# EAGLE schematic rs232_mon (EAGLE 9.6.2)
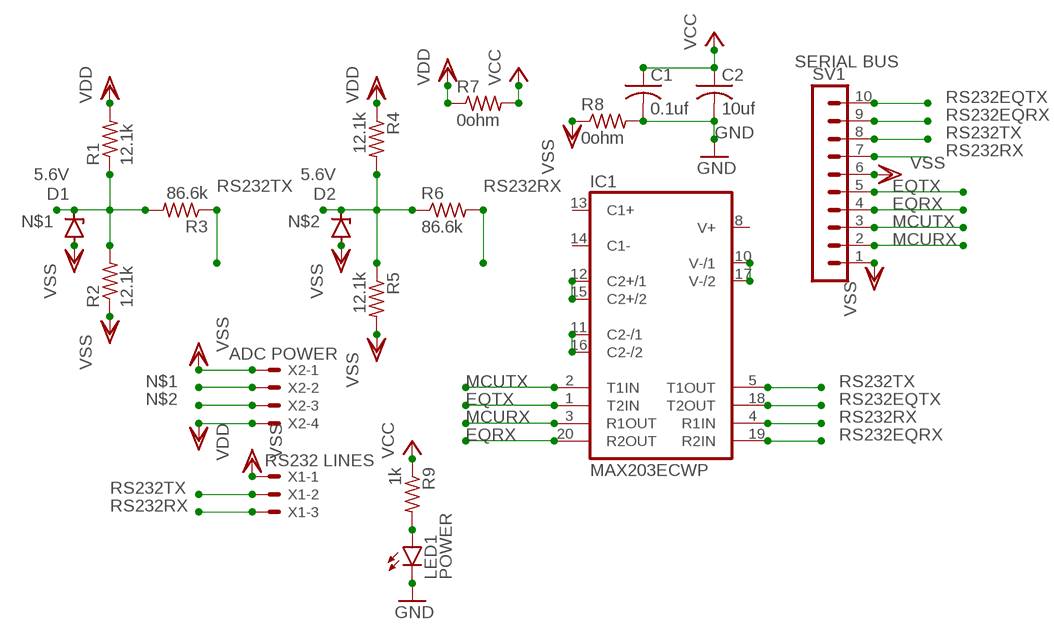
[diagram p0: schematic, sheet 1]

## Parts
C1  0.1uf  C-USC0805  [C0805]
C2  10uf  C-USC0805  [C0805]
D1  5.6V  ZENER-DIODEDO34-7  [DO34Z7]
D2  5.6V  ZENER-DIODEDO34-7  [DO34Z7]
IC1  MAX203ECWP  [SO20L]
LED1  POWER  LEDCHIP-LED0603  [CHIP-LED0603]
R1  12.1k  R-US_R0805  [R0805]
R2  12.1k  R-US_R0805  [R0805]
R3  86.6k  R-US_R0805  [R0805]
R4  12.1k  R-US_R0805  [R0805]
R5  12.1k  R-US_R0805  [R0805]
R6  86.6k  R-US_R0805  [R0805]
R7  0ohm  R-US_R0805  [R0805]
R8  0ohm  R-US_R0805  [R0805]
R9  1k  R-US_R0805  [R0805]
SV1  SERIAL BUS  MA10-1  [MA10-1]
X1  RS232 LINES  22-23-2031  [22-23-2031]
X2  ADC POWER  22-23-2041  [22-23-2041]

## Nets
EQRX: IC1.20(R2OUT) SV1.4
EQTX: IC1.1(T2IN) SV1.5
GND [current]: C1.2 C2.2 LED1.C R8.2
MCURX: IC1.3(R1OUT) SV1.2
MCUTX: IC1.2(T1IN) SV1.3
N$1: D1.C R1.1 R2.2 R3.2 X2.2
N$2: D2.C R4.2 R5.1 R6.1 X2.3
N$3: LED1.A R9.2
N$5: IC1.10(V-/1) IC1.17(V-/2)
N$6: IC1.11(C2-/1) IC1.16(C2-/2)
N$7: IC1.12(C2+/1) IC1.15(C2+/2)
RS232EQRX: IC1.19(R2IN) SV1.9
RS232EQTX: IC1.18(T2OUT) SV1.10
RS232RX: IC1.4(R1IN) R6.2 SV1.7 X1.3
RS232TX: IC1.5(T1OUT) R3.1 SV1.8 X1.2
VCC [current]: C1.1 C2.1 R7.2 R9.1
VDD [current]: R1.2 R4.1 R7.1 X2.4
VSS [current]: D1.A D2.A R2.1 R5.2 R8.1 SV1.1 SV1.6 X1.1 X2.1
Unconnected: IC1.8(V+) IC1.13(C1+) IC1.14(C1-)

## Power pins joined to a net without a drawn wire
GND: IC1.6(GND) IC1.9(GND)
VCC: IC1.7(VCC)

## Library data of the parts
C1 C2 = rcl:C-US: CAPACITOR, American symbol; SPICEPREFIX: C
D1 D2 = diode:ZENER-DIODE: Z-Diode
IC1 = maxim:MAX203ECWP: RS232 TRANSCEIVER; MPN: MAX203ECWP+G36; OC_FARNELL: 1224204; OC_NEWARK: 89K3435
LED1 = led:LED: LED OSRAM: - CHIPLED LG R971, LG N971, LY N971, LG Q971, LY Q971, LO R971, LY R971 LH N974, LH R974 LS Q976, LO Q976, LY Q976 LO Q996 - Hyper CHIPLED LW Q18S LB Q993, LB Q99A, LB R99A - SideLED LS A670, LO A670, LY A670, LG A670, LP A670 LB A673, LV A673, LT A673, LW A673 LH A674 LY A675 LS A676, LA A676, LO A676, LY A676, LW A676 LS A679, LY A679, LG A679 - Hyper Micro SIDELED® LS Y876, LA Y876, LO Y876, LY Y876 LT Y87S - SmartLED LW L88C, LW L88S LB L89C, LB L89S, LG L890 LS L89K, LO L89K, LY L89K LS L896, LA L896, LO L896, LY L896 - TOPLED LS T670, LO T670, LY T670, LG T670, LP T670 LSG T670, LSP T670, LSY T670, LOP T670, LYG T670 LG T671, LOG T671, LSG T671 LB T673, LV T673, LT T673, LW T673 LH T674 LS T676, LA T676, LO T676, LY T676, LB T676, LH T676, LSB T676, LW T676 LB T67C, LV T67C, LT T67C, LS T67K, LO T67K, LY T67K, LW E67C LS E67B, LA E67B, LO E67B, LY E67B, LB E67C, LV E67C, LT E67C LW T67C LS T679, LY T679, LG T679 LS T770, LO T770, LY T770, LG T770, LP T770 LB T773, LV T773, LT T773, LW T773 LH T774 LS E675, LA E675, LY E675, LS T675 LS T776, LA T776, LO T776, LY T776, LB T776 LHGB T686 LT T68C, LB T68C - Hyper Mini TOPLED® LB M676 - Mini TOPLED Santana® LG M470 LS M47K, LO M47K, LY M47K Source: http://www.osram.convergy.de LUXEON: - LUMILED® LXK2-PW12-R00, LXK2-PW12-S00, LXK2-PW14-U00, LXK2-PW14-V00 LXK2-PM12-R00, LXK2-PM12-S00, LXK2-PM14-U00 LXK2-PE12-Q00, LXK2-PE12-R00, LXK2-PE12-S00, LXK2-PE14-T00, LXK2-PE14-U00 LXK2-PB12-K00, LXK2-PB12-L00, LXK2-PB12-M00, LXK2-PB14-N00, LXK2-PB14-P00, LXK2-PB14-Q00 LXK2-PR12-L00, LXK2-PR12-M00, LXK2-PR14-Q00, LXK2-PR14-R00 LXK2-PD12-Q00, LXK2-PD12-R00, LXK2-PD12-S00 LXK2-PH12-R00, LXK2-PH12-S00 LXK2-PL12-P00, LXK2-PL12-Q00, LXK2-PL12-R00 Source: www.luxeon.com KINGBRIGHT: KA-3528ASYC Source: www.kingbright.com
R1-R9 = rcl:R-US_: RESISTOR, American symbol; SPICEPREFIX: R
SV1 = con-lstb:MA10-1: PIN HEADER; OC_FARNELL: unknown; OC_NEWARK: unknown
X1 = con-molex:22-23-2031: .100" (2.54mm) Center Header - 3 Pin; MF: MOLEX; MPN: 22-23-2031; OC_FARNELL: 1462950; OC_NEWARK: 30C0862
X2 = con-molex:22-23-2041: .100" (2.54mm) Center Header - 4 Pin; MF: MOLEX; MPN: 22-23-2041; OC_FARNELL: 1462920; OC_NEWARK: 38C0355

## Net classes
0 default: width 0.254 mm
1 current: width 0.508 mm